# Altium schematic sheet HP8555A_A9.SchDoc: HP8555A A9 V3
size Letter; Date: 2018-06-30; DrawnBy: Jamie Stepanian; DocumentNumber: 1; Revision: 001; SheetNumber: 1; SheetTotal: 1; SheetTitle: HP8555A A9 V3; Project: HP855A_A9_V3; ProjectAuthor: J. Stepanian; ProjectVerifiedBy: J. Stepanian; ProjectRevision: 01
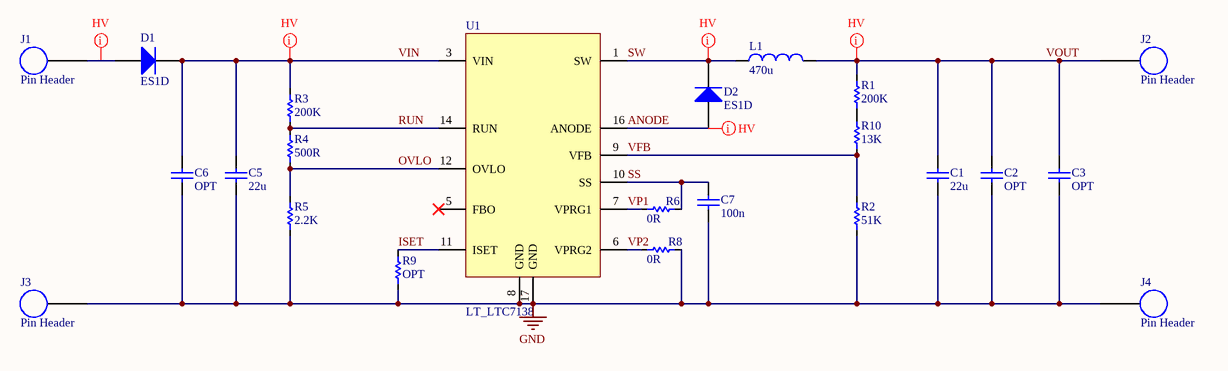
[diagram p0: HP8555A_A9.SchDoc]

## Parts
C1  22u  [CAP_1210_M]
C2  OPT  [CAP_1210_M]
C3  OPT  [CAP_ALU_GEN]
C5  22u  [CAP_2220_M]
C6  OPT  [CAP_ALU_GEN]
C7  100n  [CAP_0603_M]
D1  ES1D  [ES1D]
D2  ES1D  [ES1D]
J1  Pin Header  [PIN_HEADER_1POS]
J2  Pin Header  [PIN_HEADER_1POS]
J3  Pin Header  [PIN_HEADER_1POS]
J4  Pin Header  [PIN_HEADER_1POS]
L1  470u  [TDK_SLF12555T]
R1  200K  [RES_0603_M]
R2  51K  [RES_0603_M]
R3  200K  [RES_0603_M]
R4  500R  [RES_0603_M]
R5  2.2K  [RES_0603_M]
R6  0R  [RES_0603_M]
R8  0R  [RES_0603_M]
R9  OPT  [RES_0603_M]
R10  13K  [RES_0603_M]
U1  LT_LTC7138  [LT_LTC7138]

## Nets
GND: C1.1 C2.1 C3.1 C5.1 C6.1 C7.1 J3.1 J4.1 R2.1 R5.1 R8.2 R9.1 U1.8(GND) U1.17(GND)
ANODE: D2.2(A) U1.16(ANODE)
ISET: R9.2 U1.11(ISET)
OVLO: R4.1 R5.2 U1.12(OVLO)
RUN: R3.1 R4.2 U1.14(RUN)
SS: C7.2 R6.2 U1.10(SS)
SW: D2.1(K) L1.1 U1.1(SW)
VFB: R2.2 R10.1 U1.9(VFB)
VIN: C5.2 C6.2 D1.1(K) R3.2 U1.3(VIN)
VOUT: C1.2 C2.2 C3.2 J2.1 L1.2 R1.2
VP1: R6.1 U1.7(VPRG1)
VP2: R8.1 U1.6(VPRG2)
NetD1_2: D1.2(A) J1.1
NetR1_1: R1.1 R10.2

Not connected (* = marked no-connect by the designer): U1 5(FBO)*

## Layout directives
net class HV: ANODE, NetD1_2, SW, VIN, VOUT

## Notes on the sheet
- Number:
- Variant name
- Revision:
- Date:
- Sheet
- of
- Drawn by
- Verified by:

## Library data of the parts
C1 C2 = CAP_1210: CAP Cnom Vcap Ptol Dial 1210; Category: capacitor; Created: 2018-07-01; Created By: JS; Last Modified: 2018-07-01
C3 C6 = CAP_ALU_GEN: CAP Cnom Vcap Ptol Dial; Category: capacitor; Created: 2018-07-01; Created By: JS; Last Modified: 2018-07-01
C5 = CAP_2220: CAP Cnom Vcap Ptol Dial 2220; Category: capacitor; Created: 2018-07-01; Created By: JS; Last Modified: 2018-07-01
C7 = CAP_0603: CAP 100nF Vcap Ptol Dial 0603; Category: capacitor; Created: 2018-07-01; Created By: JS; Last Modified: 2018-07-01
D1 D2 = ES1D: DIODE 200V 1A SMA
J1-J4 = PIN_HEADER_1POS: Pin Header 0.1" 1pos
L1 = TDK_SLF12555: IND Lind Ltol Imax Rdc
R1 = RES_0805: RES OPT 1/5W 0805; Manufacturer: *; Manufacturer PN: *; Category: resistor; Created: 2018-07-01; Last Modified: 2018-07-01; Created By: JS
R2 = RES_0805: RES 51K 1/5W 0805; Manufacturer: *; Manufacturer PN: *; Category: resistor; Created: 2018-07-01; Last Modified: 2018-07-01; Created By: JS
R3 = RES_0805: RES 200K 1/5W 0805; Manufacturer: *; Manufacturer PN: *; Category: resistor; Created: 2018-07-01; Last Modified: 2018-07-01; Created By: JS
R4 = RES_0805: RES 500R 1/5W 0805; Manufacturer: *; Manufacturer PN: *; Category: resistor; Created: 2018-07-01; Last Modified: 2018-07-01; Created By: JS
R5 = RES_0805: RES 2.2K 1/5W 0805; Manufacturer: *; Manufacturer PN: *; Category: resistor; Created: 2018-07-01; Last Modified: 2018-07-01; Created By: JS
R6 R8 = RES_0603: RES 0R 1/5W 0603; Manufacturer: *; Manufacturer PN: *; Category: resistor; Created: 2018-07-01; Last Modified: 2018-07-01; Created By: JS
R9 = RES_0603: RES OPT 1/5W 0603; Manufacturer: *; Manufacturer PN: *; Category: resistor; Created: 2018-07-01; Last Modified: 2018-07-01; Created By: JS
R10 = RES_0805: RES 13K 1/5W 0805; Manufacturer: *; Manufacturer PN: *; Category: resistor; Created: 2018-07-01; Last Modified: 2018-07-01; Created By: JS
U1 = LT_LTC7138: Step Down IC 140V 400mA; Manufacturer: Linear Technology; FootREV: 01; Manufacturer PN: LTC7138